# EAGLE design interface_smd (EAGLE 7.6.0)
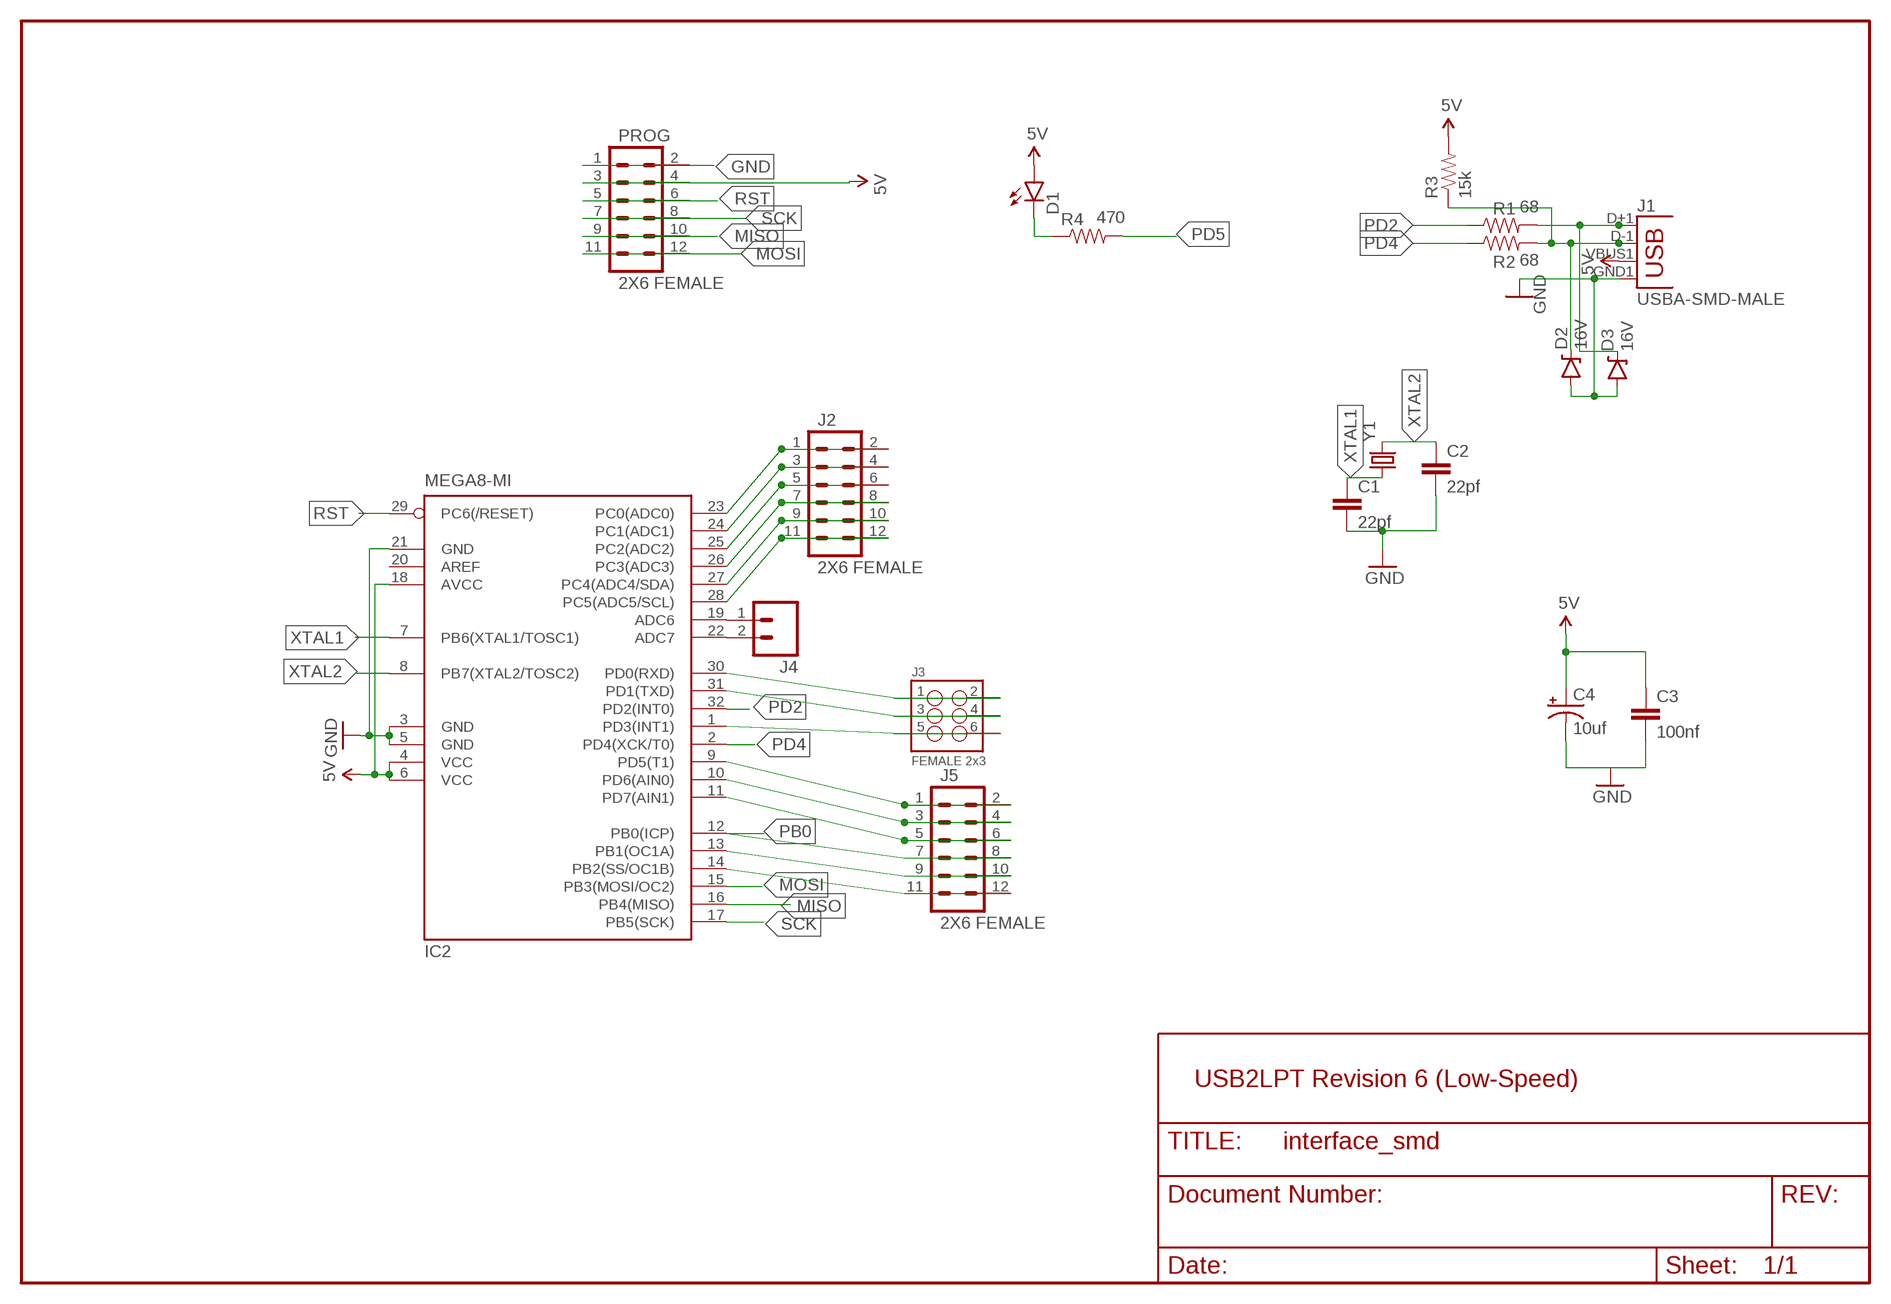
[diagram p0: schematic, sheet 1]

## Parts
C1  22pf  CAP1206  [1206]
C2  22pf  CAP1206  [1206]
C3  100nf  CAP1206  [1206]
C4  10uf  CAP_POL1206  [EIA3216]
D1  LED1206  [LED-1206]
D2  16V  DIODE-ZENER16V  [SOD-123]
D3  16V  DIODE-ZENER16V  [SOD-123]
IC2  MEGA8-MI  [MLF32]
J1  USBA-SMD-MALE  [USB-A-SMT-MALE]
J2  2X6 FEMALE  M06X2PTH_FEMALE  [2X6]
J3  FEMALE 2x3  M03X2FEMALE  [2X3]
J4  M02PTH  [1X02]
J5  2X6 FEMALE  M06X2PTH_FEMALE  [2X6]
PROG  2X6 FEMALE  M06X2PTH_FEMALE  [2X6]
R1  68  RESISTOR1206  [1206]
R2  68  RESISTOR1206  [1206]
R3  15k  RESISTOR1206  [1206]
R4  470  RESISTOR1206  [1206]
Y1  CRYSTAL10.5X4.8  [CRYSTAL-SMD-10.5X4.8-2PIN]

## Nets
5V: C3.1 C4.A(+) D1.A IC2.4(VCC) IC2.6(VCC) IC2.18(AVCC) J1.VBUS1(VBUS) PROG.3 PROG.4 R3.2
GND: C1.2 C2.2 C3.2 C4.C(-) D2.A D3.A IC2.3(GND) IC2.5(GND) IC2.21(GND) J1.GND1(GND) PROG.1 PROG.2
MISO: IC2.16(PB4(MISO)) PROG.9 PROG.10
MOSI: IC2.15(PB3(MOSI/OC2)) PROG.11 PROG.12
N$1: D1.C R4.1
N$2: IC2.23(PC0(ADC0)) J2.1 J2.2
N$3: D3.C J1.D+1(D+) R1.2
N$4: IC2.24(PC1(ADC1)) J2.3 J2.4
N$5: IC2.25(PC2(ADC2)) J2.5 J2.6
N$7: D2.C J1.D-1(D-) R2.2 R3.1
N$8: IC2.26(PC3(ADC3)) J2.7 J2.8
N$9: IC2.27(PC4(ADC4/SDA)) J2.9 J2.10
N$10: IC2.28(PC5(ADC5/SCL)) J2.11 J2.12
N$11: IC2.19(ADC6) J4.1
N$12: IC2.22(ADC7) J4.2
N$13: IC2.30(PD0(RXD)) J3.1 J3.2
N$14: IC2.31(PD1(TXD)) J3.3 J3.4
N$15: IC2.1(PD3(INT1)) J3.5 J3.6
N$17: IC2.10(PD6(AIN0)) J5.3 J5.4
N$18: IC2.11(PD7(AIN1)) J5.5 J5.6
N$19: IC2.13(PB1(OC1A)) J5.9 J5.10
N$20: IC2.14(PB2(SS/OC1B)) J5.11 J5.12
PB0: IC2.12(PB0(ICP)) J5.7 J5.8
PD2: IC2.32(PD2(INT0)) R1.1
PD4: IC2.2(PD4(XCK/T0)) R2.1
PD5: IC2.9(PD5(T1)) J5.1 J5.2 R4.2
RST: IC2.29(PC6(/RESET)) PROG.5 PROG.6
SCK: IC2.17(PB5(SCK)) PROG.7 PROG.8
XTAL1: C1.1 IC2.7(PB6(XTAL1/TOSC1)) Y1.P$1
XTAL2: C2.1 IC2.8(PB7(XTAL2/TOSC2)) Y1.P$2
Unconnected: IC2.20(AREF)

## Notes on the sheet
- USB2LPT Revision 6 (Low-Speed)

## Library data of the parts
C1-C3 = SparkFun-Passives:CAP: Capacitor Standard 0603 ceramic capacitor, and 0.1" leaded capacitor.
C4 = SparkFun-Passives1:CAP_POL: Capacitor Polarized These are standard SMD and PTH capacitors. Normally 10uF, 47uF, and 100uF in electrolytic and tantalum varieties. Always verify the external diameter of the through hole cap, it varies with capacity, voltage, and manufacturer. The EIA devices should be standard.
D1 = SparkFun-LED:LED: LEDs Standard schematic elements and footprints for 5mm, 3mm, 1206, and 0603 sized LEDs. 5mm - Spark Fun Electronics SKU : COM-00529 (and others)
D2 D3 = SparkFun-DiscreteSemi:DIODE-ZENER: Zener Diode Production Part - 8199 3.4V Zener Voltage; PROD_ID: DIO-12440
IC2 = atmel:MEGA8: MICROCONTROLLER 8 Kbytes FLASH, 1 kbytes SRAM, 512 bytes EEPROM, USART, 6-channel 10 bit ADC, 2-channel 8 bit ADC Pin compatible with Atmega48, ATMega88, ATMega168 Source: avr.lbr; MPN: ATMEGA88PA-MU; OC_FARNELL: 1715491; OC_NEWARK: 15R0272
J1 = SparkFun-Connectors:USB: USB Connectors USB-B-PTH is fully proven SKU : PRT-00139/CONN-08278 USB-miniB is fully proven SKU : PRT-00587 USB-A-PCB is untested. USB-A-H is throughly reviewed, but untested. Spark Fun Electronics SKU : PRT-00437 USB-B-SMT is throughly reviewed, but untested. Needs silkscreen touching up. USB-A-S has not been used/tested USB-MB-H has not been used/tested USB-MICROB has been used. CONN-09505
J2 J5 PROG = SparkFun-Connectors:M06X2; PROD_ID: CONN-12423
J3 = SparkFun-Connectors:M03X2: 2x3 .1" header. Shrouded, with keying- CONN-10681 SMT- CONN-11415 Pogo pins- HW-11044; PROD_ID: CONN-11566
J4 = SparkFun-Connectors:M02: Standard 2-pin 0.1" header. Use with - straight break away headers ( PRT-00116) - right angle break away headers (PRT-00553) - swiss pins (PRT-00743) - machine pins (PRT-00117) - female headers (PRT-00115) Molex polarized connector foot print use with: PRT-08233 with associated crimp pins and housings. 2.54_SCREWTERM for use with PRT-10571. 3.5mm Screw Terminal footprints for PRT-08084 5mm Screw Terminal footprints for use with PRT-08432
R1-R4 = SparkFun-Passives:RESISTOR: Resistor Basic schematic elements and footprints for 0603, 1206, and PTH resistors.
Y1 = SparkFun-FreqCtrl:CRYSTAL: Various standard crystals. Proven footprints.

## Net classes
0 default: width 0.4 mm, drill 0.8 mm, clearance 0.5 mm

## Board
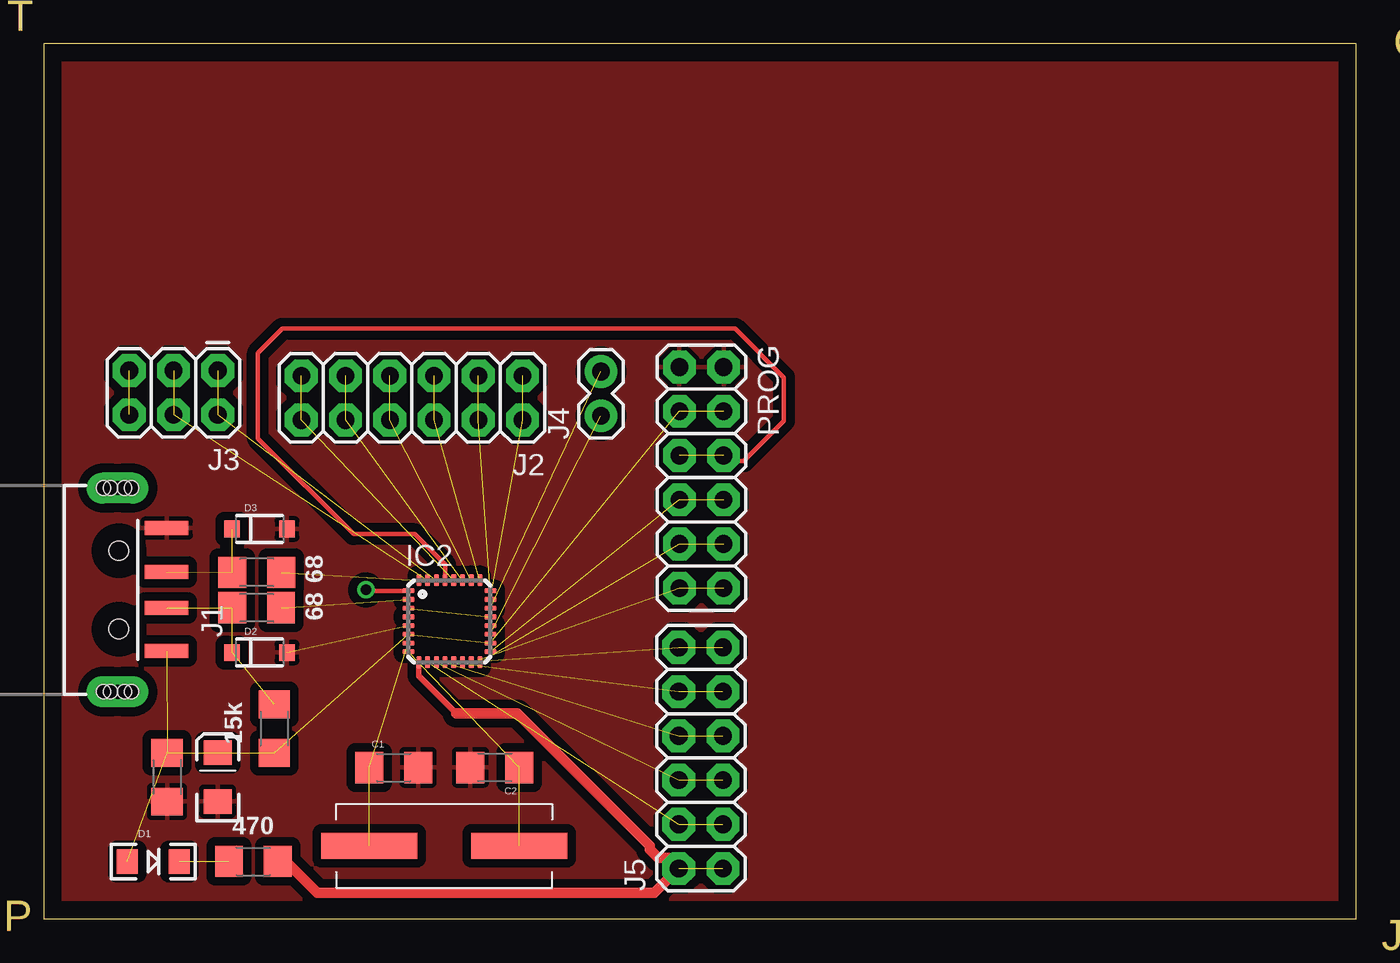
[diagram p1: board, top side]
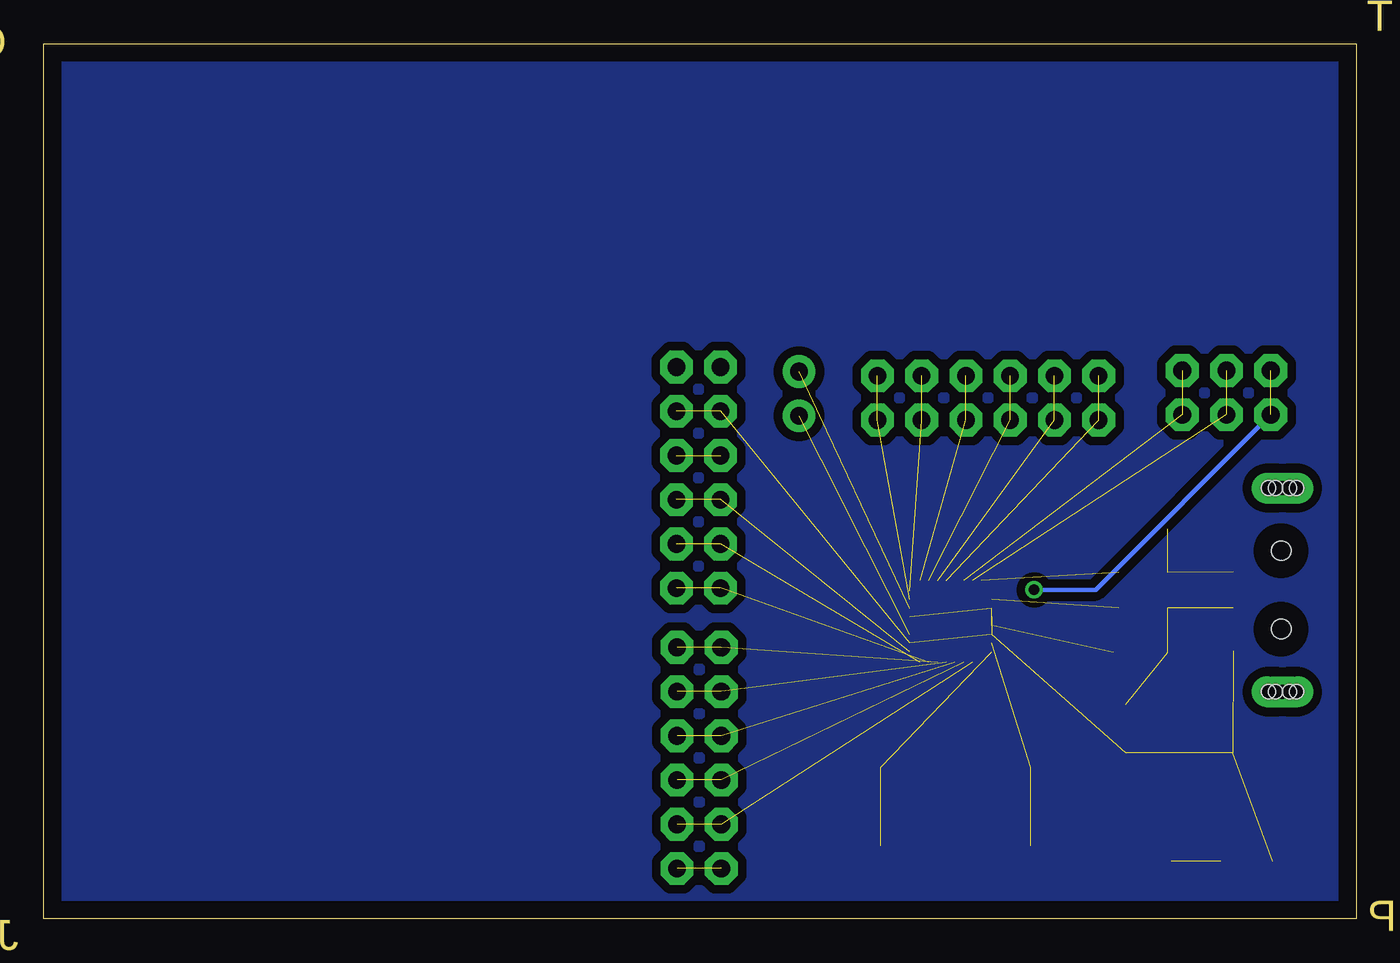
[diagram p2: board, bottom side, seen from below]

Size 75.37 x 50.28 mm. Coordinates in mm from the lower left corner, seen from the top.
Outline: 0,0 75.37,0 75.37,50.28 0,50.28 0,0
Copper layers (1*16): Top 0.035mm / dielectric 1.5mm / Bottom 0.035mm
Design rules "default": minimum track width 10mil, minimum drill 24mil, track to track 8mil, track to pad 8mil, pad to pad 8mil, via to via 8mil, smd to smd 8mil, copper to edge 40mil, drill to drill 8mil, minimum pad ring 10mil, minimum via ring 8mil, stop-mask expansion 4mil, vias tented up to drill 0mil, thermal gap 10mil

### Footprints (pad centres in the part's own frame; a part is rotated, then mirrored left to right if it is on the bottom)
1206 = smd 1.6 x 1.8: 1 -1.4,0; 2 1.4,0
EIA3216 = smd 1.4 x 1.6: A 1.4,0; C -1.4,0
LED-1206 = smd 1.2 x 1.4: A -1.5,0; C 1.5,0
SOD-123 = smd 0.9 x 0.95: A 1.575,0; C -1.575,0
MLF32 = smd 0.7 x 0.3: 1 -2.35,1.75; 2 -2.35,1.25; 3 -2.35,0.75; 4 -2.35,0.25; 5 -2.35,-0.25; 6 -2.35,-0.75; 7 -2.35,-1.25; 8 -2.35,-1.75; 17 2.35,-1.75; 18 2.35,-1.25; 19 2.35,-0.75; 20 2.35,-0.25; 21 2.35,0.25; 22 2.35,0.75; 23 2.35,1.25; 24 2.35,1.75 | smd 0.3 x 0.7: 9 -1.75,-2.35; 10 -1.25,-2.35; 11 -0.75,-2.35; 12 -0.25,-2.35; 13 0.25,-2.35; 14 0.75,-2.35; 15 1.25,-2.35; 16 1.75,-2.35; 25 1.75,2.35; 26 1.25,2.35; 27 0.75,2.35; 28 0.25,2.35; 29 -0.25,2.35; 30 -0.75,2.35; 31 -1.25,2.35; 32 -1.75,2.35
USB-A-SMT-MALE = smd 0.8 x 2.5: D+1 1.027,-5.87; D-1 -1.027,-5.87; GND1 3.551,-5.87; VBUS1 -3.5,-5.87 | drill 0.8 pad 1.778 long: P$1 5.85,-3.05; P$3 -5.85,-3.05 | hole 1.1: 2.25,-3.12; -2.25,-3.12 | hole 0.8: -5.85,-3.45; -5.85,-3.85; -5.85,-2.65; -5.85,-2.25; 5.85,-3.45; 5.85,-3.85; 5.85,-2.65; 5.85,-2.25
2X6 = drill 1.016 pad 1.88 octagon: 1 0,0; 2 0,2.54; 3 2.54,0; 4 2.54,2.54; 5 5.08,0; 6 5.08,2.54; 7 7.62,0; 8 7.62,2.54; 9 10.16,0; 10 10.16,2.54; 11 12.7,0; 12 12.7,2.54
2X3 = drill 1.016 pad 1.88 octagon: 1 0,0; 2 0,2.54; 3 2.54,0; 4 2.54,2.54; 5 5.08,0; 6 5.08,2.54
1X02 = drill 1.016 pad 1.88: 1 0,0; 2 2.54,0
CRYSTAL-SMD-10.5X4.8-2PIN = smd 5.5 x 1.5: P$1 -4.3,0; P$2 4.3,0

### Placement (x,y rotation side)
C1  20.1,8.7 0 top
C2  25.9,8.7 180 top
C3  7.09,8.15 270 top
C4  9.99,8.15 90 top
D1  6.3,3.3 0 top
D2  12.4,15.3 0 top
D3  12.4,22.4 0 top
IC2  23.3,17.1 0 top
J1  1.2,18.9 90 top
J2  27.5,31.2 180 top
J3  10,31.5 180 top
J4  32,28.9 90 top
J5  39,2.9 90 top
PROG  36.5,31.7 270 top
R1  12.24,19.91 180 top
R2  12.23,17.87 180 top
R3  13.24,10.93 270 top
R4  12.04,3.31 0 top
Y1  23,4.2 0 top

### Tracks (layer width: path | path; a pad name or v marks a point on that pad's centre or on a via)
5V  (9 unrouted)
GND  (3 unrouted)
  pour Top (isolate 0.254): 0,-0.25 0,50.25 75.75,50.25 75.75,-0.25
MISO  (2 unrouted)
MOSI  (2 unrouted)
N$1  (1 unrouted)
N$2  (2 unrouted)
N$3  (2 unrouted)
N$4  (2 unrouted)
N$5  (2 unrouted)
N$6
  pour Bottom: 0,0 -0.3,0 -0.3,50.5 75.7,50.5 75.7,-0.1 0,-0.1
N$7  (3 unrouted)
N$8  (2 unrouted)
N$9  (2 unrouted)
N$10  (2 unrouted)
N$11  (1 unrouted)
N$12  (1 unrouted)
N$13  (2 unrouted)
N$14  (2 unrouted)
N$15  (via drill 0.6)  (1 unrouted)
  Top 0.254: IC2.1 18.55,18.85 v18.5,18.9
  Bottom 0.254: v18.5,18.9 14.98,18.9 J3.6
N$17  (2 unrouted)
N$18  (2 unrouted)
N$19  (2 unrouted)
N$20  (2 unrouted)
PB0  (2 unrouted)
PD2  (1 unrouted)
PD4  (1 unrouted)
PD5  (1 unrouted)
  Top 0.305: IC2.9 21.55,13.95 23.7,11.8
  Top 0.61: R4.2 13.89,3.31 15.7,1.5 35.06,1.5 J5.2 35.86,3.5 35.3,3.5 34.8,4 34.8,4.2 27.2,11.8 23.7,11.8
RST  (1 unrouted)
  Top 0.254: IC2.29 23.05,20.35 21.3,22.1 17.8,22.1 12.3,27.6 12.3,32.5 13.7,33.9 39.7,33.9 42.5,31.1 42.5,28.6 40.2,26.3 39.36,26.3 PROG.6
SCK  (2 unrouted)
XTAL1  (2 unrouted)
XTAL2  (2 unrouted)

### Text on the board
Dimension: T | O | P | J